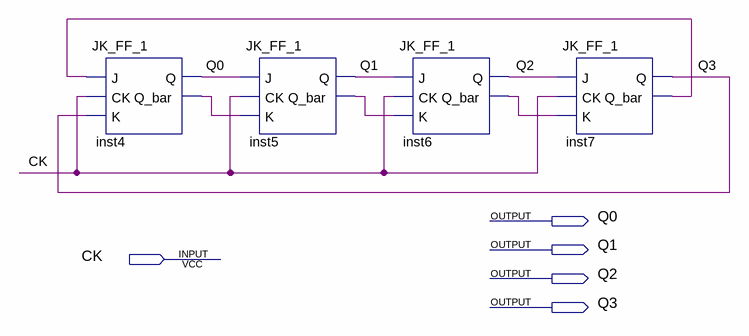
[diagram p0: schematic sheet]
// Quartus schematic 8_MOD_Johnson_JK.bdf as structural Verilog: 4 symbols, 5 pins
module \8_MOD_Johnson_JK  (
  input  CK,
  output Q0,
  output Q1,
  output Q2,
  output Q3
);

  wire inst4_q_bar, inst5_q_bar, inst6_q_bar, inst7_q_bar;

  JK_FF_1 inst4 (.J(inst7_q_bar), .CK(CK), .K(Q3), .Q(Q0), .Q_bar(inst4_q_bar));
  JK_FF_1 inst5 (.J(Q0), .CK(CK), .K(inst4_q_bar), .Q(Q1), .Q_bar(inst5_q_bar));
  JK_FF_1 inst6 (.J(Q1), .CK(CK), .K(inst5_q_bar), .Q(Q2), .Q_bar(inst6_q_bar));
  JK_FF_1 inst7 (.J(Q2), .CK(CK), .K(inst6_q_bar), .Q(Q3), .Q_bar(inst7_q_bar));
endmodule
